# Altium schematic sheet US_Sensor-board.SchDoc
size A4; SheetNumber: 1; SheetTotal: 1
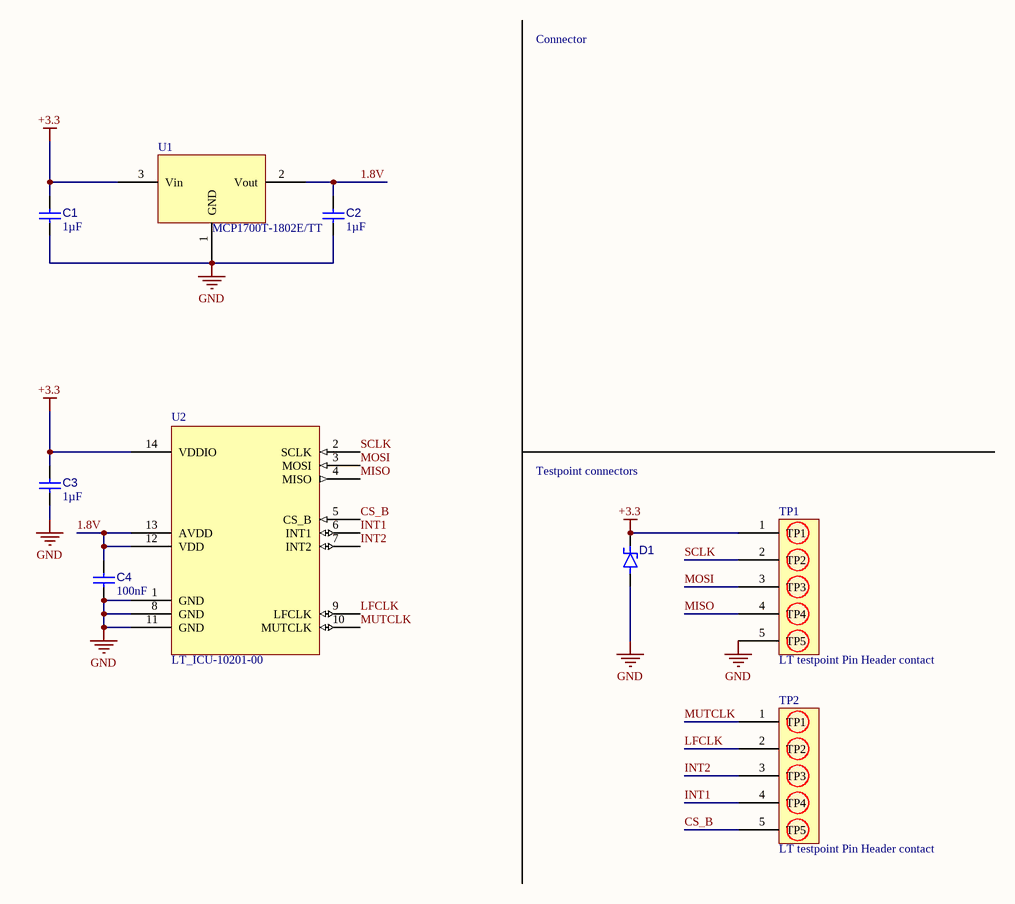
[diagram p0: US_Sensor-board.SchDoc]

## Parts
C1  value 1µF  [LT_Capacitor_1uF-Footprint-1]  (hidden comment: 1uF)
C2  value 1µF  [LT_Capacitor_1uF-Footprint-1]  (hidden comment: 1uF)
C3  value 1µF  [LT_Capacitor_1uF-Footprint-1]  (hidden comment: 1uF)
C4  100nF  [CAPC1608X08N]
D1  MM3Z9V1B - RVP  [SOD323-F - RVP]  (value not drawn)
TP1  LT testpoint Pin Header contact  [New footprint 1]
TP2  LT testpoint Pin Header contact  [New footprint 1]
U1  MCP1700T-1802E/TT  [MCP1700T-1802E/TT]
U2  LT_ICU-10201-00  [LT_ICU-10201-00-Footprint-1]

## Nets
+3.3: C1.2 C3.2 D1.1(K) TP1.1(TP1) U1.3(Vin) U2.14(VDDIO)
GND: C1.1 C2.1 C3.1 C4.1 D1.2(A) TP1.5(TP5) U1.1(GND) U2.1(GND) U2.8(GND) U2.11(GND)
1.8V: C2.2 C4.2 U1.2(Vout) U2.12(VDD) U2.13(AVDD)
CS_B: TP2.5(TP5) U2.5(CS_B)
INT1: TP2.4(TP4) U2.6(INT1)
INT2: TP2.3(TP3) U2.7(INT2)
LFCLK: TP2.2(TP2) U2.9(LFCLK)
MISO: TP1.4(TP4) U2.4(MISO)
MOSI: TP1.3(TP3) U2.3(MOSI)
MUTCLK: TP2.1(TP1) U2.10(MUTCLK)
SCLK: TP1.2(TP2) U2.2(SCLK)

## Notes on the sheet
- Connector
- Testpoint connectors

## Library data of the parts
C1-C3 = CMP-001-00094-6: SMD Multilayer Ceramic Capacitor, 1 µF, 6.3 V, 0603 [1608 Metric], ± 10%, X7R; Pins: 2; ComponentLink1Description: Farnell; Case/Package: 0603; ComponentLink1URL: https://ee.farnell.com/kemet/c0603c105k9rac7411/cap-1uf-6-3v-mlcc-0603/dp/3508545; Capacitor Type: SMD
C4 = CMP-001-00095-3: SMD Multilayer Ceramic Capacitor, 0.1 µF, 25 V, 0603 [1608 Metric], ± 10%, X7R; Case/Package: 0603; Value: 100nF; ComponentLink1Description: Farnell; Pins: 2; Capacitor Type: SMD; ComponentLink1URL: https://ee.farnell.com/kemet/c0603c104k3ractu/cap-0-1-f-25v-10-x7r-0603/dp/1650835
D1 = CMP-004-00031-3: Zener Single Diode, 9.1 V, 200 mW, SOD-323F, 2 Pins, 150 °C, Surface Mount; Forward Current: 5mA; Peak Inverse Voltage: 6V; Forward Voltage: 9.1V; Case/Package: SOD-323F; ComponentLink1URL: https://ee.farnell.com/on-semiconductor/mm3z9v1b/zener-diode-0-2w-9-1v-sod-323f/dp/2454001; ComponentLink2Description: Datasheet; ComponentLink1Description: Farnell; Mounting Technology: SMD; Max Operating Temperature: 150°C; Min Operating Temperature: -65°C; ComponentLink2URL: http://www.farnell.com/datasheets/1706525.pdf; Pins: 2
TP1 TP2 = CMP-002-00080-1: 5 pin testpoint contact; Gender: F; Pins: 5
U1 = CMP-019-00050-5: Fixed LDO Voltage Regulator, 2.3V to 6V, 178mV Dropout, 1.8Vout, 200mAout, SOT-23-3; Output Voltage: 1.8V; Output Current: 250mA; Max Operating Temperature: 125°C; Max Supply Voltage: 6V; ComponentLink1Description: Farnell; ComponentLink1URL: https://ee.farnell.com/microchip/mcp1700t-1802e-tt/ic-v-reg-ldo-250ma-smd-sot-23/dp/1296591; Dropout Voltage: 178mV; Pins: 3; Min Supply Voltage: 1.8V; Case/Package: SOT-23; Min Operating Temperature: -40°C
U2 = CMP-031-00007-3: High-performance, miniature, ultra-low power, long-range ultrasonic transceiver.; Min Operating Temperature: -40°C; Max Operating Temperature: 85°C; Pins: 14; Case/Package: LGA; ComponentLink1Description: Farnell; ComponentLink1URL: https://ee.farnell.com/tdk/icu-10201-00/ultrasonic-sensor-tof-1-2m-lga/dp/4712307